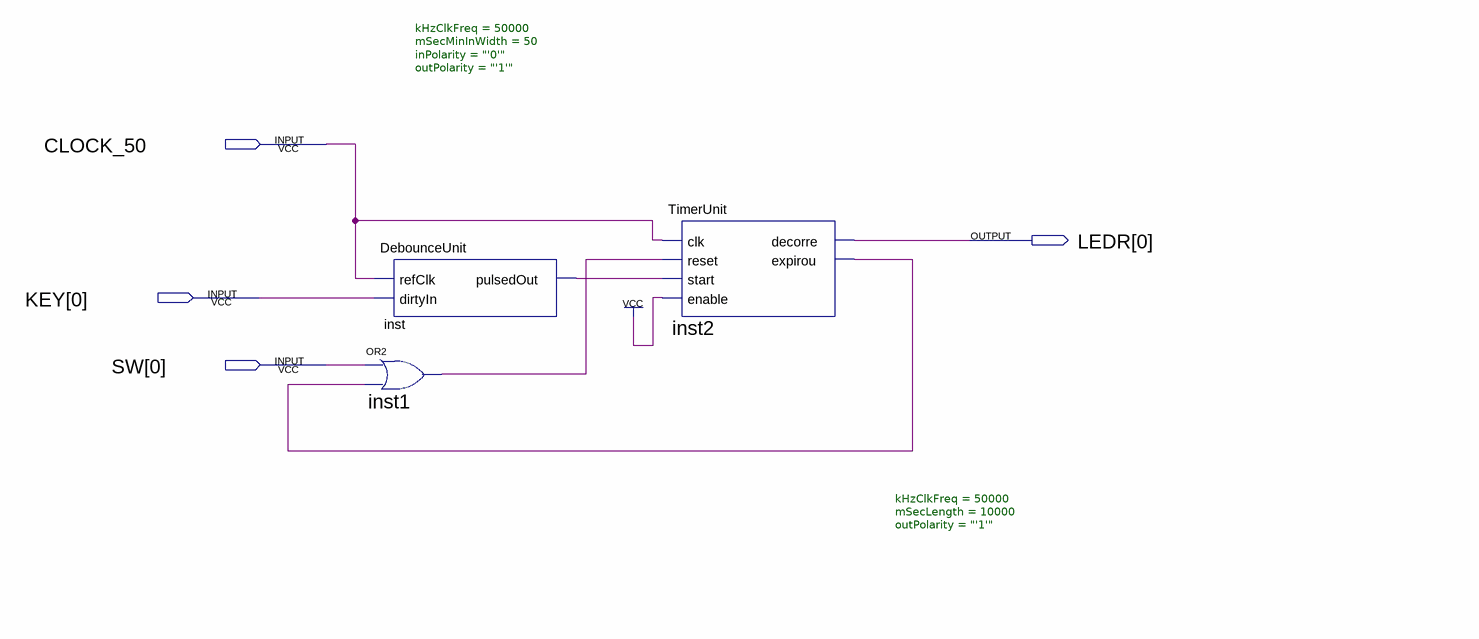
[diagram p0: schematic sheet]
// Quartus schematic MicroProjectoDemo.bdf as structural Verilog: 3 symbols, 4 pins
module MicroProjectoDemo (
  input  CLOCK_50,
  input  [0:0] KEY,
  input  [0:0] SW,
  output [0:0] LEDR
);

  wire inst1_out, inst2_expirou, inst_pulsedout;

  or inst1 (inst1_out, SW[0], inst2_expirou);
  DebounceUnit #(.kHzClkFreq(50000), .mSecMinInWidth(50), .inPolarity("'0'"), .outPolarity("'1'")) inst (
    .refClk(CLOCK_50), .dirtyIn(KEY[0]), .pulsedOut(inst_pulsedout));
  TimerUnit #(.kHzClkFreq(50000), .mSecLength(10000), .outPolarity("'1'")) inst2 (
    .clk(CLOCK_50), .reset(inst1_out), .start(inst_pulsedout), .enable(1'b1), .decorre(LEDR[0]),
    .expirou(inst2_expirou));
endmodule
